# EAGLE design EnvironmentMonitorV5 (EAGLE 7.4.0)
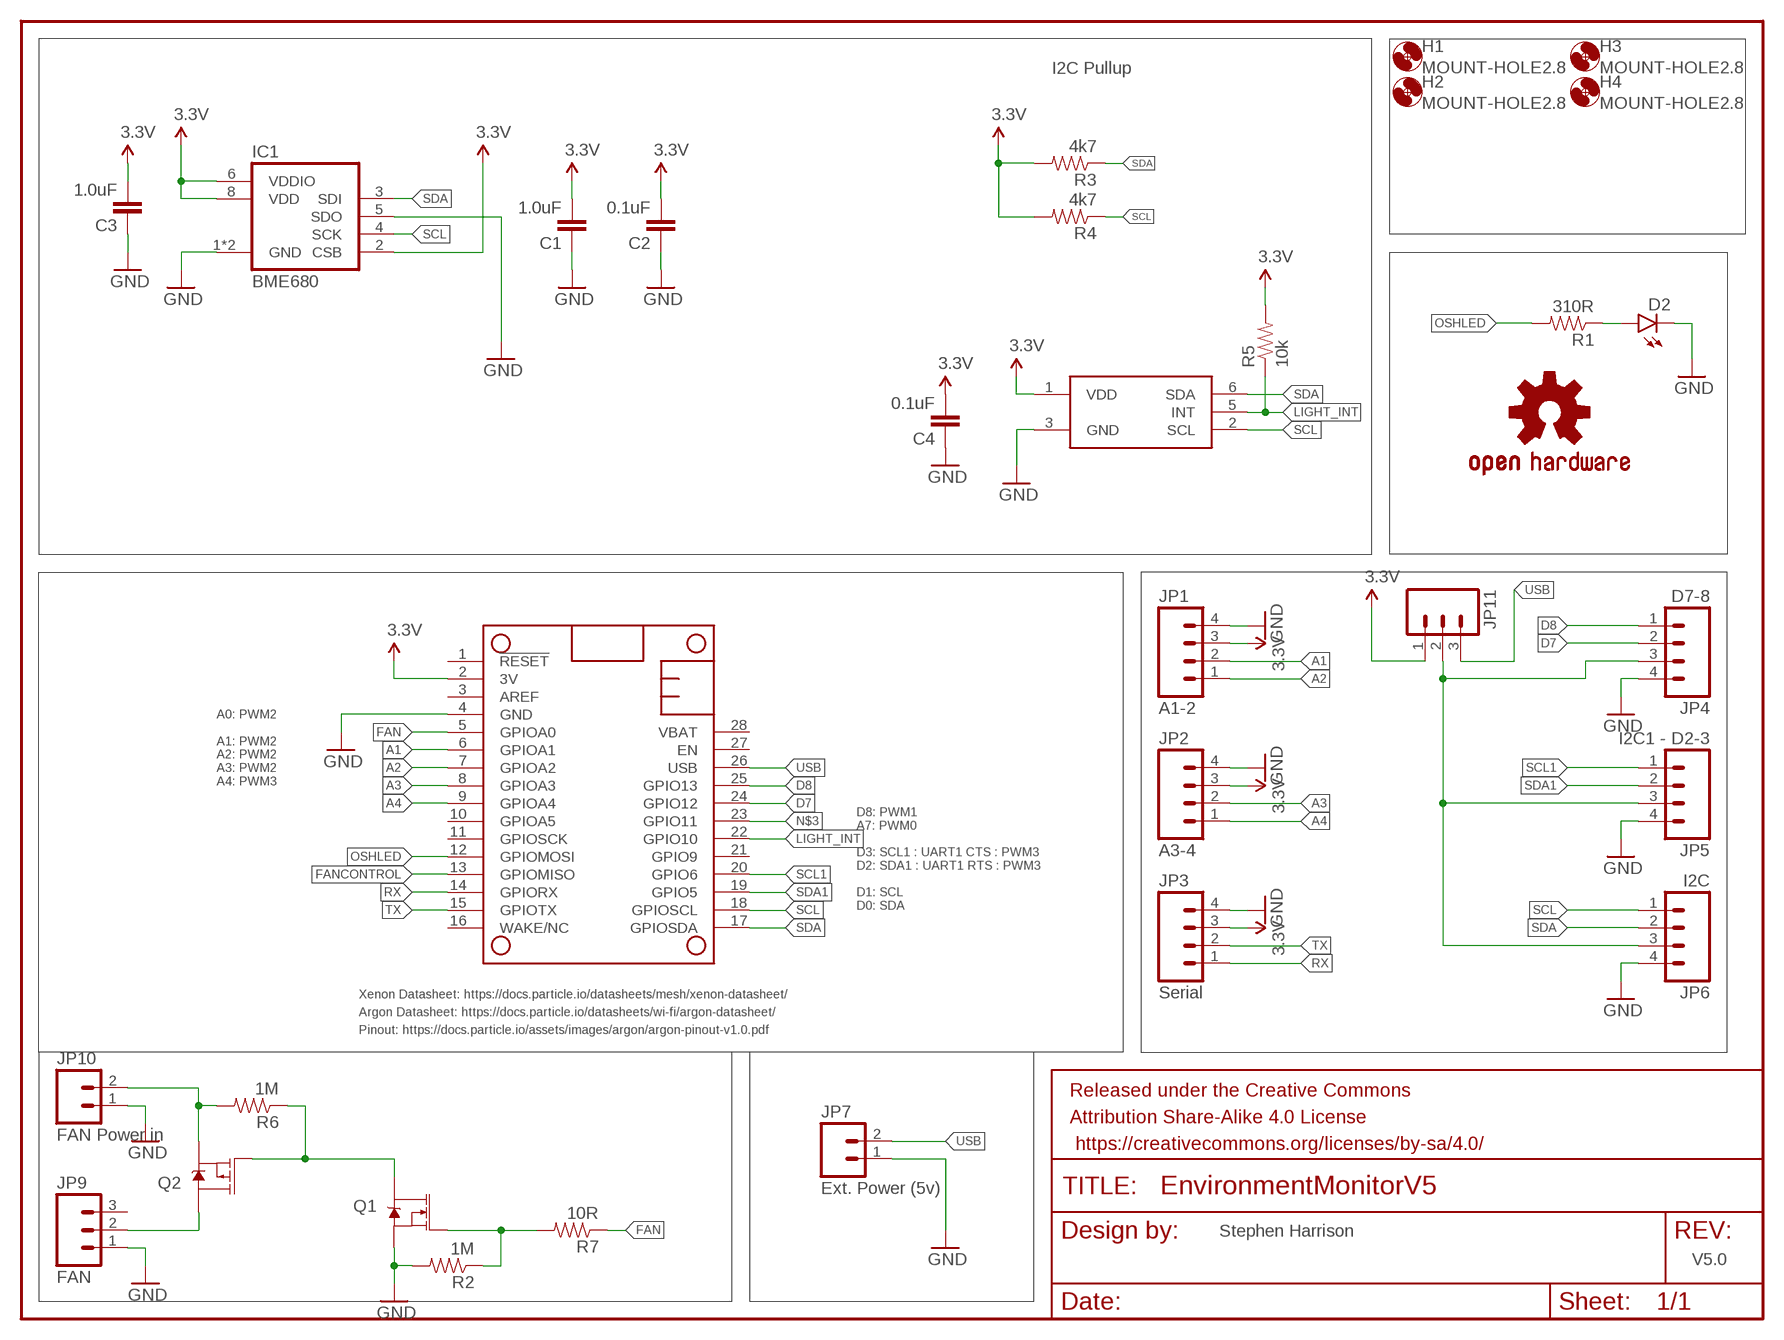
[diagram p0: schematic, sheet 1]

## Parts
C1  1.0uF  1.0UF-25V-+80/-20(0805)"  [0805-CAP]
C2  0.1uF  1.0UF-25V-+80/-20(0805)"  [0805-CAP]
C3  1.0uF  1.0UF-25V-+80/-20(0805)"  [0805-CAP]
C4  0.1uF  1.0UF-25V-+80/-20(0805)"  [0805-CAP]
D2  LED1206-BOTTOM  [LED-1206-BOTTOM]
FRAME1  FRAME-LETTER  [CREATIVE_COMMONS]
H1  MOUNT-HOLE2.8  [2,8]
H2  MOUNT-HOLE2.8  [2,8]
H3  MOUNT-HOLE2.8  [2,8]
H4  MOUNT-HOLE2.8  [2,8]
IC1  BME680  [BME680]
IC2  TCS3472  [FN-6]
JP1  A1-2  M04JST-PTH-VERT  [JST-4-PTH-VERT]
JP2  A3-4  M04JST-PTH-VERT  [JST-4-PTH-VERT]
JP3  Serial  M04JST-PTH-VERT  [JST-4-PTH-VERT]
JP4  D7-8  M04JST-PTH-VERT  [JST-4-PTH-VERT]
JP5  I2C1 - D2-3  M04JST-PTH-VERT  [JST-4-PTH-VERT]
JP6  I2C  M04JST-PTH-VERT  [JST-4-PTH-VERT]
JP7  Ext. Power (5v)  M02POLAR_LOCK  [MOLEX-1X2_LOCK]
JP9  FAN  M03POLAR  [MOLEX-1X3]
JP10  FAN Power in  M02POLAR_LOCK  [MOLEX-1X2_LOCK]
JP11  M03PTH  [1X03]
LOGO1  OSHW-LOGOM  [OSHW-LOGO-M]
MS1  FEATHERWING_NODIM  [FEATHERWING_DIM]
Q1  220mA/50V/3.5Ω  MOSFET-NCH-BSS138  [SOT23-3]
Q2  4.3A/20V/54mΩ  MOSFET_PCH-IRLML2244  [SOT23-3]
R1  310R  RESISTOR0805-RES  [0805]
R2  1M  RESISTOR0805-RES  [0805]
R3  4k7  RESISTOR0805-RES  [0805]
R4  4k7  RESISTOR0805-RES  [0805]
R5  10k  RESISTOR0805-RES  [0805]
R6  1M  RESISTOR0805-RES  [0805]
R7  10R  RESISTOR0805-RES  [0805]

## Nets
3.3V: C1.2 C2.2 C3.2 C4.2 IC1.2(CSB) IC1.6(VDDIO) IC1.8(VDD) IC2.1(VDD) JP1.3 JP2.3 JP3.3 JP11.1 MS1.2(3V) R3.2 R4.2 R5.2
A1: JP1.2 MS1.6(GPIOA1)
A2: JP1.1 MS1.7(GPIOA2)
A3: JP2.2 MS1.8(GPIOA3)
A4: JP2.1 MS1.9(GPIOA4)
D7: JP4.2 MS1.24(GPIO12)
D8: JP4.1 MS1.25(GPIO13)
FAN: MS1.5(GPIOA0) R7.1
FANCONTROL: MS1.13(GPIOMISO)
GND: C1.1 C2.1 C3.1 C4.1 D2.C IC1.1(GND) IC1.5(SDO) IC1.7(GND) IC2.3(GND) JP1.4 JP2.4 JP3.4 JP4.4 JP5.4 JP6.4 JP7.1 JP9.1 JP10.1 MS1.4(GND) Q1.2(S) R2.2
LIGHT_INT: IC2.5(INT) MS1.22(GPIO10) R5.1
N$1: JP10.2 Q2.2(S) R6.2
N$2: Q1.3(D) Q2.1(G) R6.1
N$3: MS1.23(GPIO11)
N$4: JP4.3 JP5.3 JP6.3 JP11.2
N$5: Q1.1(G) R2.1 R7.2
N$6: D2.A R1.1
N$8: JP9.2 Q2.3(D)
OSHLED: MS1.12(GPIOMOSI) R1.2
RX: JP3.1 MS1.14(GPIORX)
SCL: IC1.4(SCK) IC2.2(SCL) JP6.1 MS1.18(GPIOSCL) R4.1
SCL1: JP5.1 MS1.20(GPIO6)
SDA: IC1.3(SDI) IC2.6(SDA) JP6.2 MS1.17(GPIOSDA) R3.1
SDA1: JP5.2 MS1.19(GPIO5)
TX: JP3.2 MS1.15(GPIOTX)
USB: JP7.2 JP11.3 MS1.26(USB)
Unconnected: JP9.3 MS1.1(!RESET) MS1.3(AREF) MS1.10(GPIOA5) MS1.11(GPIOSCK) MS1.16(WAKE/NC) MS1.21(GPIO9) MS1.27(EN) MS1.28(VBAT)

## Notes on the sheet
- I2C Pullup
- A0: PWM2
  
  A1: PWM2
  A2: PWM2
  A3: PWM2
  A4: PWM3
- D8: PWM1
  A7: PWM0
  
  D3: SCL1 : UART1 CTS : PWM3
  D2: SDA1 : UART1 RTS : PWM3
  
  D1: SCL
  D0: SDA
- Xenon Datasheet: https://docs.particle.io/datasheets/mesh/xenon-datasheet/
- Argon Datasheet: https://docs.particle.io/datasheets/wi-fi/argon-datasheet/
- Pinout: https://docs.particle.io/assets/images/argon/argon-pinout-v1.0.pdf
- Stephen Harrison
- V5.0

## Library data of the parts
C1 C3 = SparkFun-Capacitors:1.0UF-25V-+80/-20(0805): CAP-11625; PROD_ID: CAP-11625
C2 C4 = SparkFun-Capacitors:1.0UF-25V-+80/-20(0805): CAP-11625; PROD_ID: CAP-11625; VALUE: 1.0uF
D2 = SparkFun-LED:LED: LEDs Standard schematic elements and footprints for 5mm, 3mm, 1206, and 0603 sized LEDs. 5mm - Spark Fun Electronics SKU : COM-00529 (and others)
FRAME1 = SparkFun-Aesthetics:FRAME-LETTER: Schematic Frame Standard 8.5x11 US Letter frame
H1-H4 = holes:MOUNT-HOLE: MOUNTING HOLE with drill center marker
IC1 = ThingySticks:BME680: BME680 integrates for the first time individual high linearity and high accuracy sensors for gas, pressure, humidity and temperature. The library has been designed by Richard Magdycz <https://www.facebook.com/groups/eaglecadsoftUK> Original version had pins in incorrect places (BME680 uses untypical clockwise direction). Updated 17 Feb 2018 S.Harrison ThingySticks.com
IC2 = TCS3472:TCS3472
JP1 = SparkFun-Connectors:M04: Header 4 Standard 4-pin 0.1" header. Use with straight break away headers (SKU : PRT-00116), right angle break away headers (PRT-00553), swiss pins (PRT-00743), machine pins (PRT-00117), and female headers (PRT-00115). Molex polarized connector foot print use with SKU : PRT-08231 with associated crimp pins and housings. 1MM SMD Version SKU: PRT-10208; CPC: MK00368; SEEEDSTUDIO: 110990030
JP2-JP6 = SparkFun-Connectors:M04: Header 4 Standard 4-pin 0.1" header. Use with straight break away headers (SKU : PRT-00116), right angle break away headers (PRT-00553), swiss pins (PRT-00743), machine pins (PRT-00117), and female headers (PRT-00115). Molex polarized connector foot print use with SKU : PRT-08231 with associated crimp pins and housings. 1MM SMD Version SKU: PRT-10208
JP7 JP10 = SparkFun-Connectors:M02: Standard 2-pin 0.1" header. Use with - straight break away headers ( PRT-00116) - right angle break away headers (PRT-00553) - swiss pins (PRT-00743) - machine pins (PRT-00117) - female headers (PRT-00115) Molex polarized connector foot print use with: PRT-08233 with associated crimp pins and housings. 2.54_SCREWTERM for use with PRT-10571. 3.5mm Screw Terminal footprints for PRT-08084 5mm Screw Terminal footprints for use with PRT-08432
JP9 JP11 = SparkFun-Connectors:M03: Header 3 Standard 3-pin 0.1" header. Use with straight break away headers (SKU : PRT-00116), right angle break away headers (PRT-00553), swiss pins (PRT-00743), machine pins (PRT-00117), and female headers (PRT-00115). Molex polarized connector foot print use with SKU : PRT-08232 with associated crimp pins and housings.
LOGO1 = SparkFun-Aesthetics:OSHW-LOGO: Open Source Hardware Logo This logo indicates the piece of hardware it is found on incorporates a OSHW license and/or adheres to the definition of open source hardware found here: http://freedomdefined.org/OSHW
MS1 = ThingySticks:FEATHERWING
Q1 = SparkFun-DiscreteSemi:MOSFET-NCH: N-channel MOSFETs Voltage controlled devices that allow control of high current outputs. SparkFun Products: SparkFun OpenScale <https://www.sparkfun.com/products/13261> SparkFun Digital Sandbox <https://www.sparkfun.com/products/12651> SparkFun Monster Moto Shield <https://www.sparkfun.com/products/10182> SparkFun MOSFET Power Controller <https://www.sparkfun.com/products/11214>; PROD_ID: TRANS-00830
Q2 = SparkFun-DiscreteSemi:MOSFET_PCH: P-channel MOSFETs Voltage controlled devices that allow control of high current outputs. SparkFun Products: SparkFun ESP32 Thing <https://www.sparkfun.com/products/13907> SparkFun ESP8266 Thing <https://www.sparkfun.com/products/13231>; PROD_ID: TRANS-11153
R1-R7 = SparkFun-Resistors:RESISTOR: Resistor Basic schematic elements and footprints for 0603, 1206, and PTH resistors.

## Board
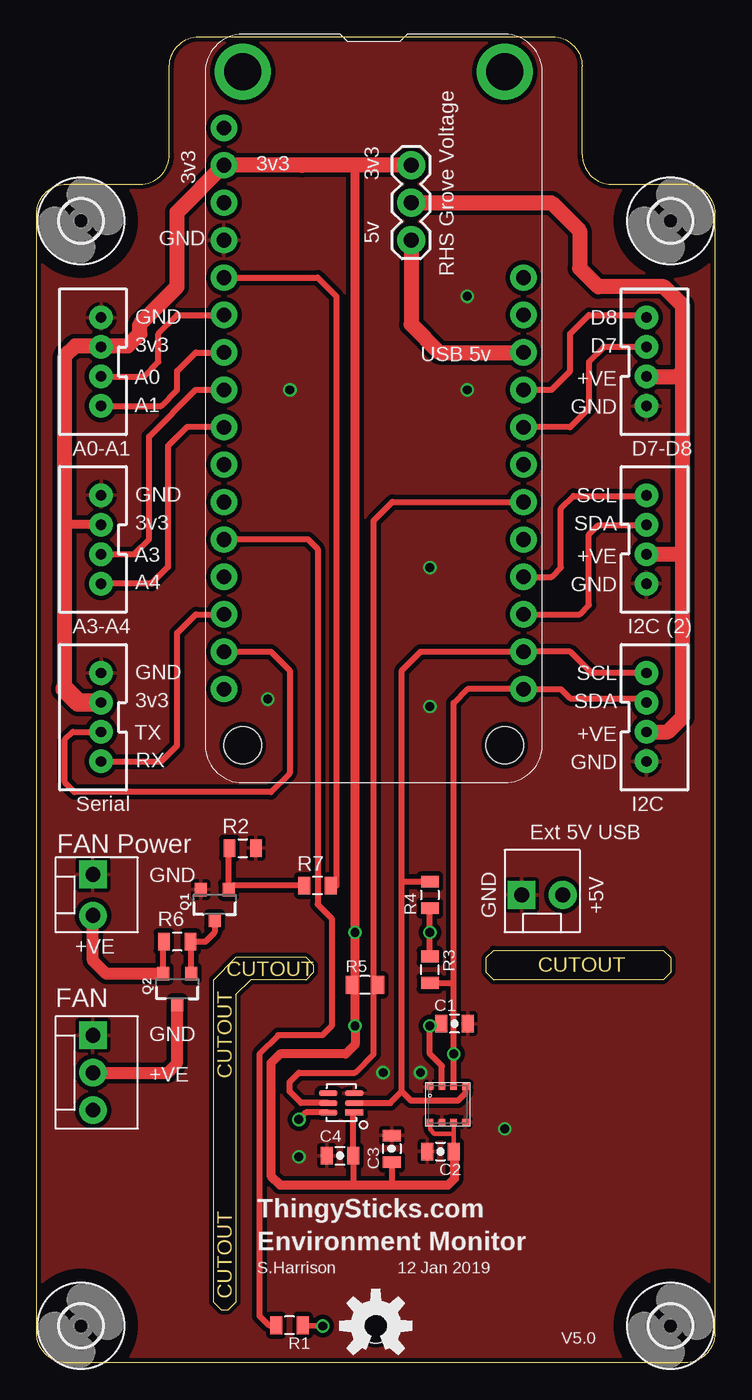
[diagram p1: board, top side]
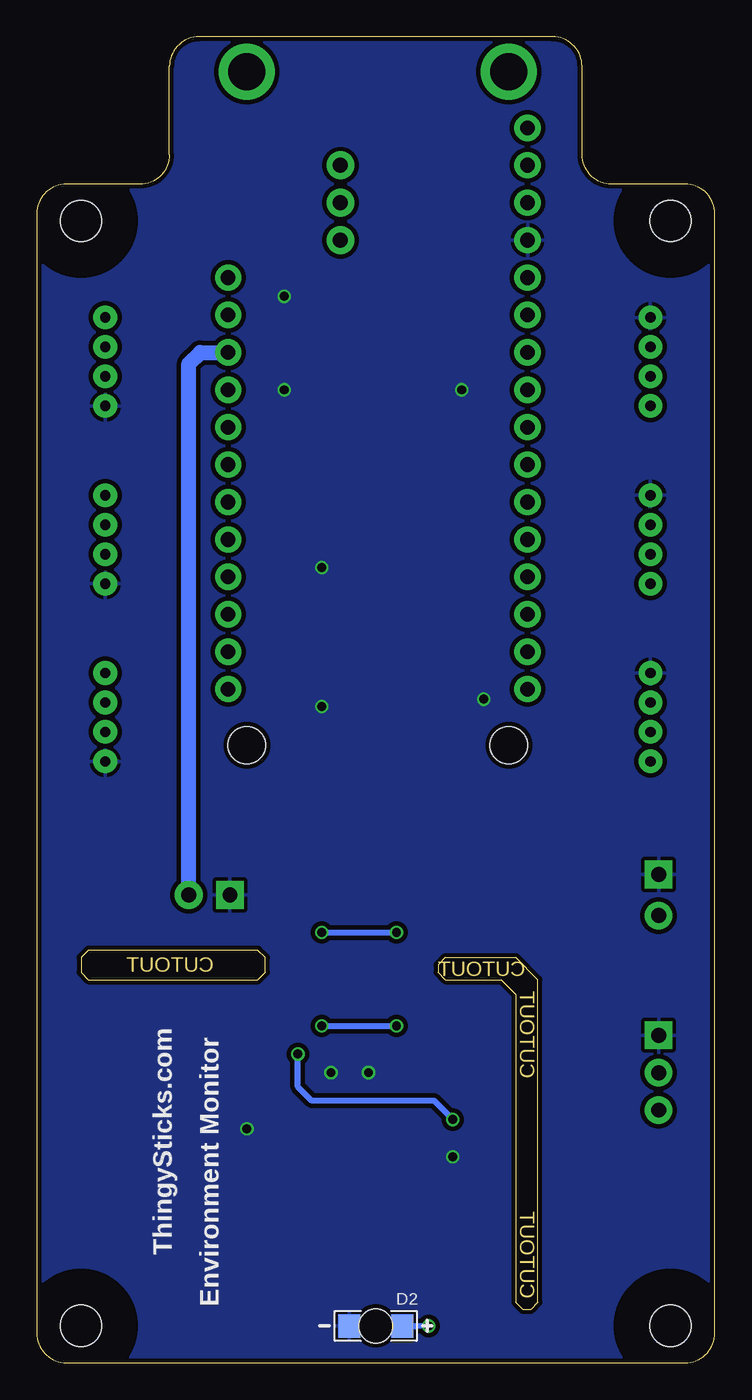
[diagram p2: board, bottom side, seen from below]

Size 46 x 90 mm. Coordinates in mm from the lower left corner, seen from the top.
Outline: 0,2 0,78 arc-90 2,80 7,80 arc90 9,82 9,88 arc-90 11,90 35,90 arc-90 37,88 37,82 arc90 39,80 44,80 arc-90 46,78 46,2 arc-90 44,0 2,0 arc-90 0,2
Outline: 12,4.1 12,26 13.5,27.5 18.27,27.5 18.77,27 18.77,26.5 18.27,26 14.5,26 13.5,25 13.5,4.1 13,3.6 12.5,3.6 12,4.1
Outline: 31,28 42.5,28 43,27.5 43,26.5 42.5,26 31,26 30.5,26.5 30.5,27.5 31,28
Copper layers (1*16): Top 0.035mm / dielectric 1.5mm / Bottom 0.035mm
Design rules "dirt_cheap_dirty_boards.v1": minimum track width 5mil, minimum drill 12mil, track to track 5mil, track to pad 5mil, pad to pad 5mil, via to via 5mil, smd to smd 0mil, copper to edge 10mil, drill to drill 10mil, minimum pad ring 10mil, minimum via ring 6mil, stop-mask expansion 2mil, vias tented up to drill 25mil, thermal gap 10mil

### Footprints (pad centres in the part's own frame; a part is rotated, then mirrored left to right if it is on the bottom)
0805-CAP = smd 0.8 x 1.2: 1 -0.9,0; 2 0.9,0
LED-1206-BOTTOM = smd 1.5 x 1.6: A -1.8,0; C 1.8,0 | hole 2.3: 0,0
2,8 = hole 2.8: 0,0
BME680 = smd 0.45 x 0.45: 1 1.2,-1.2; 2 0.4,-1.2; 3 -0.4,-1.2; 4 -1.2,-1.2; 5 -1.2,1.2; 6 -0.4,1.2; 7 0.4,1.2; 8 1.2,1.2
FN-6 = smd 1.25 x 0.4: 1 -0.875,0.65; 2 -0.875,0; 3 -0.875,-0.65; 4 0.875,-0.65; 5 0.875,0; 6 0.875,0.65
JST-4-PTH-VERT = drill 0.7 pad 1.6: 1 -3,-0.55; 2 -1,-0.55; 3 1,-0.55; 4 3,-0.55
MOLEX-1X2_LOCK = drill 1.016 pad 1.88 square: 1 -0.127,0 | drill 1.016 pad 1.88: 2 2.667,0
MOLEX-1X3 = drill 1.016 pad 1.88 square: 1 0,0 | drill 1.016 pad 1.88: 2 2.54,0; 3 5.08,0
1X03 = drill 1.016 pad 1.88: 1 0,0; 2 2.54,0; 3 5.08,0
FEATHERWING_DIM = drill 1 pad 1.778: 1 6.35,1.27; 2 8.89,1.27; 3 11.43,1.27; 4 13.97,1.27; 5 16.51,1.27; 6 19.05,1.27; 7 21.59,1.27; 8 24.13,1.27; 9 26.67,1.27; 10 29.21,1.27; 11 31.75,1.27; 12 34.29,1.27; 13 36.83,1.27; 14 39.37,1.27; 15 41.91,1.27; 16 44.45,1.27; 17 44.45,21.59; 18 41.91,21.59; 19 39.37,21.59; 20 36.83,21.59; 21 34.29,21.59; 22 31.75,21.59; 23 29.21,21.59; 24 26.67,21.59; 25 24.13,21.59; 26 21.59,21.59; 27 19.05,21.59; 28 16.51,21.59 | drill 2.5 pad 3.81: P$1 2.54,20.32; P$2 2.54,2.54 | hole 2.54: 48.26,20.32; 48.26,2.54
SOT23-3 = smd 0.8 x 0.9: 1 -0.95,-1; 2 0.95,-1; 3 0,1.1
0805 = smd 0.8 x 1.2: 1 -0.9,0; 2 0.9,0

### Placement (x,y rotation side)
C1  28.35,23.01 180 top
C2  27.39,14.34 0 top
C3  24.08,14.52 270 top
C4  20.57,14.05 0 top
D2  23,2.5 180 bottom
FRAME1  -2.54,-23.5 0 top  (outside the outline)
H1  3,2.5 0 top
H2  3,77.5 0 top
H3  43,2.5 0 top
H4  43,77.5 0 top
IC1  27.89,17.53 180 top
IC2  20.66,17.64 180 top
JP1  3.81,67.94 90 top
JP2  3.81,55.88 90 top
JP3  3.81,43.81 90 top
JP4  41.91,67.94 270 top
JP5  41.91,55.88 270 top
JP6  41.91,43.81 270 top
JP7  33.02,31.75 0 top
JP9  3.81,22.23 270 top
JP10  3.81,33.02 270 top
JP11  25.4,81.28 270 top
LOGO1  23,2.5 0 top
MS1  11.43,90.17 270 top
Q1  12.06,31.11 180 top
Q2  9.53,25.4 180 top
R1  17.14,2.54 180 top
R2  13.97,34.92 0 top
R3  26.67,26.67 90 top
R4  26.67,31.75 270 top
R5  22.27,25.65 180 top
R6  9.53,28.57 180 top
R7  19.05,32.38 180 top

### Tracks (layer width: path | path; a pad name or v marks a point on that pad's centre or on a via)
3.3V  (via drill 0.6)
  Top 0.305: 27.43,18.78 IC1.2 | C2.2 28.29,15.54 | 28.29,15.54 IC1.6 | IC1.8 26.68,15.84 26.98,15.54 28.29,15.54
  Top 0.406: IC2.1 21.48,16.92 C4.2 21.48,12.18 21.59,12.06 | R4.2 v26.67,29.21 R3.2 | C3.2 24.08,12.12 24.77,12.06 | IC1.2 27.48,20.14 26.67,20.95 v26.67,22.86 26.82,23.01 C1.2 | 21.68,55.34 21.59,55.24 | R5.2 21.52,25.65 21.59,25.72
  Top 0.61: C2.2 28.35,14.28 28.35,12.5 27.91,12.06 24.77,12.06 21.59,12.06 16.51,12.06 15.88,12.7 15.88,20.32 16.51,20.95 20.95,20.95 21.59,21.59 v21.59,22.86 21.59,25.72 v21.59,29.21 21.59,55.24 21.59,81.1 21.5,81.19 21.59,81.28 | JP2.3 2.02,56.88 1.91,57 | 18.22,81.5 18,81.28
  Top 1.016: 1.91,45.72 1.91,57 1.91,68.35 2.59,69.04 4.27,69.04 | 4.27,69.04 JP1.3 | 4.27,69.04 6.17,69.04 6.99,69.85 6.99,70.48 9.53,73.03 9.53,78.11 MS1.2 18,81.28 21.59,81.28 JP11.1
  Top 1.27: JP3.3 2.81,44.81 1.91,45.72
  Bottom 0.406: v26.67,29.21 v21.59,29.21 | v26.67,22.86 v21.59,22.86
A1
  Top 0.406: JP1.2 7.25,66.94 8.26,67.94 8.26,69.85 9.53,71.12 MS1.6
A2
  Top 0.406: JP1.1 8.43,64.94 9.53,66.04 9.53,67.31 10.79,68.58 MS1.7
A3
  Top 0.406: JP2.2 6.62,54.88 7.62,55.88 7.62,62.87 10.79,66.04 MS1.8
A4
  Top 0.406: MS1.9 10.16,63.5 8.89,62.23 8.89,54 7.77,52.88 JP2.1
D7
  Top 0.406: JP4.2 38.47,68.94 37.47,67.94 37.47,64.77 36.2,63.5 MS1.24
D8
  Top 0.406: MS1.25 34.92,66.04 36.2,67.31 36.2,69.85 37.47,71.12 41.19,71.12 JP4.1
FAN
  Top 0.406: MS1.5 19.05,73.66 20.32,72.39 20.32,32.38 R7.1
GND  (via drill 0.6)
  other vias: 17.78,13.97 26.04,19.68 31.75,15.88 29.21,66.04 26.67,53.98 23.5,19.68 17.17,66.04 26.67,44.54 15.67,45.04 29.21,72.39
  pour Bottom (isolate 0.305, rank 6): 46.52,91.19 46.62,-1.44 -0.94,-1.44 -0.73,91.19
  pour Top (isolate 0.305, rank 6): -0.73,91.19 46.52,91.15 46.62,-1.47 -0.94,-1.44
LIGHT_INT
  Top 0.406: IC2.5 17.93,17.64 17.14,18.41 17.14,19.05 17.78,19.68 21.59,19.68 22.86,20.95 22.86,25.72 | 22.86,25.72 22.86,57.15 24.13,58.42 MS1.22 | R5.1 22.93,25.65 22.86,25.72
N$1
  Top 0.406: Q2.2 8.57,28.52 R6.2
  Top 0.813: Q2.2 4.71,26.4 3.81,27.3 JP10.2
N$2
  Top 0.406: Q2.1 10.47,28.52 R6.1 11.43,28.57 12.06,29.21 Q1.3
N$4
  Top 1.016: JP11.2 34.92,78.74 36.83,76.83 36.83,74.3 38.1,73.03 42.55,73.03 43.81,71.75 43.81,67.31 | JP6.3 42.81,42.81 43.81,43.81 43.81,54.61 | 43.81,54.61 43.81,67.31 | JP4.3 43.45,66.94 43.81,67.31 | JP5.3 43.55,54.88 43.81,54.61
N$5
  Top 0.406: R7.2 13.29,32.38 Q1.1 13.02,34.87 R2.1
N$6  (via drill 0.6)
  Top 0.406: R1.1 19.43,2.52 v19.41,2.49
  Bottom 0.406: v19.41,2.49 20.32,2.47 D2.A
N$8
  Top 0.813: JP9.2 8.89,19.68 9.53,20.32 Q2.3
OSHLED
  Top 0.406: R1.2 15.74,2.54 15.11,3.17 15.11,20.95 16.38,22.23 19.37,22.23 20,22.86 20,30.16 19.05,31.11 19.05,55.24 18.41,55.88 MS1.12
RX
  Top 0.406: JP3.1 8.43,40.81 9.53,41.91 9.53,49.53 10.79,50.8 MS1.14
SCL
  Top 0.406: JP6.1 37.64,46.81 36.2,48.26 MS1.18 26.04,48.26 24.77,46.99 24.77,32.65 | IC1.4 29.09,18.29 28.57,17.78 25.4,17.78 24.77,18.41 | 24.77,18.41 24.77,32.65 | IC2.2 23.98,17.64 24.77,18.41 | R4.1 24.77,32.65
SCL1
  Top 0.406: MS1.20 34.92,53.34 35.56,53.98 35.56,57.96 36.42,58.83 41.31,58.83 JP5.1
SDA  (via drill 0.6)
  Top 0.406: JP6.2 41.09,45.09 36.2,45.09 35.56,45.72 MS1.17 29.21,45.72 28.29,44.8 28.29,25.77 | IC1.3 v28.29,20.95 28.29,25.77 | R3.1 28.29,25.77 | IC2.6 18.25,16.98 v17.78,16.51
  Bottom 0.406: v17.78,16.51 19.05,17.78 27.34,17.78 IC1.3 v28.29,20.95
SDA1
  Top 0.406: MS1.19 36.83,50.8 37.47,51.44 37.47,56.21 38.1,56.84 41.33,56.84 JP5.2
TX
  Top 0.406: MS1.15 15.88,48.26 17.14,46.99 17.14,40.01 15.88,38.73 2.54,38.73 1.91,39.37 1.91,42.29 2.44,42.82 4.35,42.82 JP3.2
USB
  Top 1.016: JP11.3 25.4,70.48 27.3,68.58 MS1.26
  Bottom 1.016: JP7.2 35.69,67.82 34.92,68.58 MS1.26

### Text on the board
Dimension: CUTOUT | CUTOUT | CUTOUT | CUTOUT
tNames: RHS Grove Voltage | 3v3 | 3v3 | 3v3 | GND | 5v | D8 | GND | D7 | 3v3 | USB 5v | +VE | A0 | GND | A1 | A0-A1 | D7-D8 | SCL | GND | 3v3 | SDA | +VE | A3 | GND | A4 | A3-A4 | I2C (2) | SCL | GND | SDA | 3v3 | +VE | TX | GND | RX | Serial | I2C | Ext 5V USB | FAN Power | GND | GND | +5V | +VE | FAN | GND | +VE | ThingySticks.com | Environment Monitor | S.Harrison | 12 Jan 2019 | V5.0
bNames: ThingySticks.com | Environment Monitor